# Altium schematic sheet NodeIO.SchDoc
size A4; PageSetup: Record=PageOptions|CenterHorizontal=True|CenterVertical=True|PrintScale=1.00|XCorrection=1.00|YCorrection=1.00|PrintKind=1|BorderSize=5000000|LeftOffset=0|BottomOffset=0|Orientation=2|PaperLength=1000|PaperWidth=1000|Scale=100|PaperSource=7|PrintQuality=-3|MediaType=1|DitherType=10|PrintScaleMode=0|PaperKind=A4|PaperIndex=9
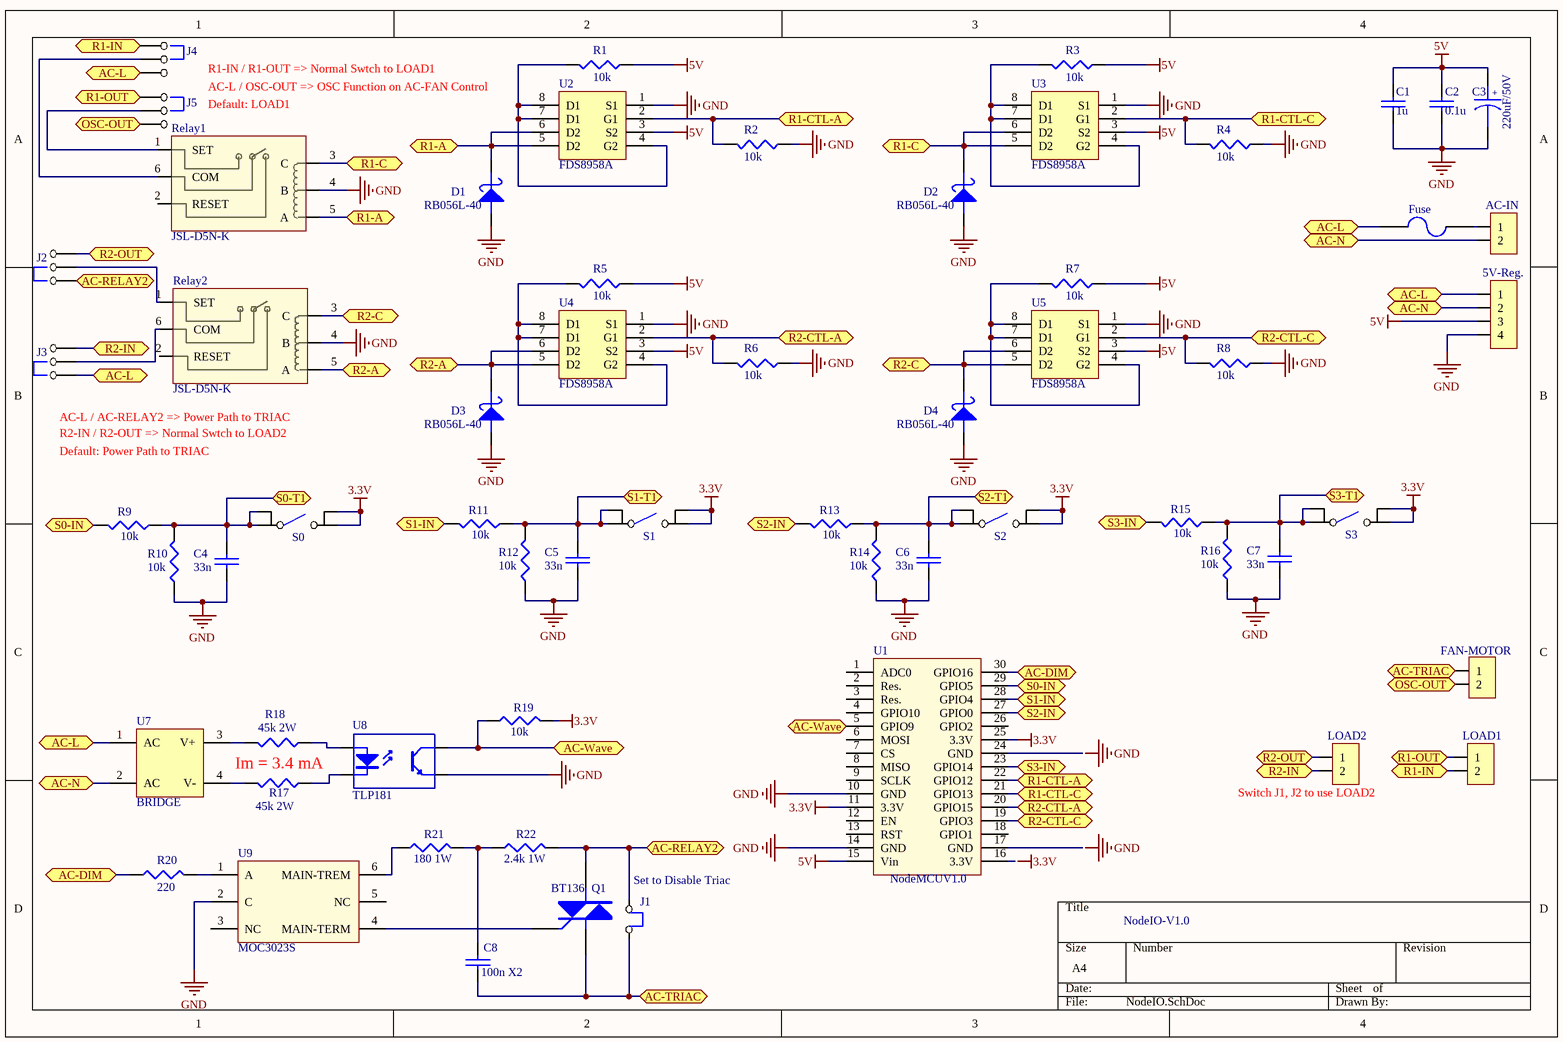
[diagram p0: NodeIO.SchDoc]

## Parts
5V-Reg.  (no value)
AC-IN  (no value)
C1  1u  [C_SMD_2012-0805]
C2  0.1u  [C_SMD_2012-0805]
C3  220uF/50V  [C_ECEL_G]
C4  33n  [C_SMD_2012-0805]
C5  33n  [C_SMD_2012-0805]
C6  33n  [C_SMD_2012-0805]
C7  33n  [C_SMD_2012-0805]
C8  100n X2  [Cap-B32933-EPCOS]
D1  RB056L-40  [DIODE_RB056L-40TE25]
D2  RB056L-40  [DIODE_RB056L-40TE25]
D3  RB056L-40  [DIODE_RB056L-40TE25]
D4  RB056L-40  [DIODE_RB056L-40TE25]
FAN-MOTOR  (no value)
Fuse  (no value)
J1  (no value)  [JUMP 7.5A]
J2  (no value)  [JP_3S_2.0mm]
J3  (no value)  [JP_3S_2.0mm]
J4  (no value)  [JP_3S_2.0mm]
J5  (no value)  [JP_3S_2.0mm]
LOAD1  (no value)
LOAD2  (no value)
Q1  BT136  [TO220V]
R1  10k  [R_2012-0805]
R2  10k  [R_2012-0805]
R3  10k  [R_2012-0805]
R4  10k  [R_2012-0805]
R5  10k  [R_2012-0805]
R6  10k  [R_2012-0805]
R7  10k  [R_2012-0805]
R8  10k  [R_2012-0805]
R9  10k  [R_2012-0805]
R10  10k  [R_2012-0805]
R11  10k  [R_2012-0805]
R12  10k  [R_2012-0805]
R13  10k  [R_2012-0805]
R14  10k  [R_2012-0805]
R15  10k  [R_2012-0805]
R16  10k  [R_2012-0805]
R17  45k 2W  [R_2W_TH]
R18  45k 2W  [R_2W_TH]
R19  10k  [R_2012-0805]
R20  220  [R_2012-0805]
R21  180 1W  [R_2W_TH]
R22  2.4k 1W  [R_2W_TH]
Relay1  JSL-D5N-K  [RELAY-JSL-DxxN-K]
Relay2  JSL-D5N-K  [RELAY-JSL-DxxN-K]
S0  SW-SPST_4_PIN  [SW-TD-06XB-Z]  (value not drawn)
S1  SW-SPST_4_PIN  [SW-TD-06XB-Z]  (value not drawn)
S2  SW-SPST_4_PIN  [SW-TD-06XB-Z]  (value not drawn)
S3  SW-SPST_4_PIN  [SW-TD-06XB-Z]  (value not drawn)
U1  NodeMCUV1.0  [NodeMCUV1.0]
U2  FDS8958A  [SO-8]
U3  FDS8958A  [SO-8]
U4  FDS8958A  [SO-8]
U5  FDS8958A  [SO-8]
U7  BRIDGE  [Bridge-MB8S]
U8  TLP181  [TLP181]
U9  MOC3023S  [SOIC6]

## Ports
AC-DIM, AC-L, AC-N, AC-RELAY2, AC-TRIAC, AC-Wave, OSC-OUT, R1-A, R1-C, R1-CTL-A, R1-CTL-C, R1-IN, R1-OUT, R2-A, R2-C, R2-CTL-A, R2-CTL-C, R2-IN, R2-OUT, S0-IN, S0-T1, S1-IN, S1-T1, S2-IN, S2-T1, S3-IN, S3-T1

## Nets
3.3V: R19.2 S0.3 S0.4 S1.3 S1.4 S2.3 S2.4 S3.3 S3.4 U1.11(3.3V) U1.25(3.3V)
5V: 5V-Reg..3 C1.1 C2.1 C3.1 R1.1 R3.1 R5.1 R7.1 U1.15(Vin) U2.3(S2) U3.3(S2) U4.3(S2) U5.3(S2)
GND: 5V-Reg..4 C1.2 C2.2 C3.2 C4.2 C5.2 C6.2 C7.2 D1.1(A) D2.1(A) D3.1(A) D4.1(A) R2.1 R4.1 R6.1 R8.1 R10.1 R12.1 R14.1 R16.1 Relay1.4(B) Relay2.4(B) U1.10(GND) U1.14(GND) U2.1(S1) U3.1(S1) U4.1(S1) U5.1(S1) U8.3(E) U9.2(C)
AC-DIM: R20.1 U1.30(GPIO16) ; port AC-DIM
AC-L: 5V-Reg..1 Fuse.1 J3.1 J4.3 U7.1(AC) ; port AC-L
AC-N: 5V-Reg..2 AC-IN.2 U7.2(AC) ; port AC-N
AC-RELAY2: J1.1 J2.1 Q1.2(A2) R22.2 ; port AC-RELAY2
AC-TRIAC: C8.1 FAN-MOTOR.1 J1.2 Q1.1(A1) ; port AC-TRIAC
AC-Wave: R19.1 U1.5(GPIO9) U8.4(C) ; port AC-Wave
OSC-OUT: FAN-MOTOR.2 J5.3 ; port OSC-OUT
R1-A: D1.2(K) Relay1.5(A) U2.5(D2) U2.6(D2) ; port R1-A
R1-C: D2.2(K) Relay1.3(C) U3.5(D2) U3.6(D2) ; port R1-C
R1-CTL-A: R2.2 U1.22(GPIO12) U2.2(G1) ; port R1-CTL-A
R1-CTL-C: R4.2 U1.21(GPIO13) U3.2(G1) ; port R1-CTL-C
R1-IN: J4.1 LOAD1.2 ; port R1-IN
R1-OUT: J5.1 LOAD1.1 ; port R1-OUT
R2-A: D3.2(K) Relay2.5(A) U4.5(D2) U4.6(D2) ; port R2-A
R2-C: D4.2(K) Relay2.3(C) U5.5(D2) U5.6(D2) ; port R2-C
R2-CTL-A: R6.2 U1.20(GPIO15) U4.2(G1) ; port R2-CTL-A
R2-CTL-C: R8.2 U1.19(GPIO3) U5.2(G1) ; port R2-CTL-C
R2-IN: J3.3 LOAD2.2 ; port R2-IN
R2-OUT: J2.3 LOAD2.1 ; port R2-OUT
S0-IN: R9.2 U1.29(GPIO5) ; port S0-IN
S0-T1: C4.1 R9.1 R10.2 S0.1 S0.2 ; port S0-T1
S1-IN: R11.2 U1.28(GPIO4) ; port S1-IN
S1-T1: C5.1 R11.1 R12.2 S1.1 S1.2 ; port S1-T1
S2-IN: R13.2 U1.27(GPIO0) ; port S2-IN
S2-T1: C6.1 R13.1 R14.2 S2.1 S2.2 ; port S2-T1
S3-IN: R15.2 U1.23(GPIO14) ; port S3-IN
S3-T1: C7.1 R15.1 R16.2 S3.1 S3.2 ; port S3-T1
NetAC-IN_1: AC-IN.1 Fuse.2
NetC8_2: C8.2 R21.2 R22.1
NetJ2_2: J2.2 Relay2.1(SET)
NetJ3_2: J3.2 Relay2.6(COM)
NetJ4_2: J4.2 Relay1.6(COM)
NetJ5_2: J5.2 Relay1.1(SET)
NetQ1_3: Q1.3(G) U9.4(MAIN-TERM)
NetR1_2: R1.2 U2.4(G2) U2.7(D1) U2.8(D1)
NetR3_2: R3.2 U3.4(G2) U3.7(D1) U3.8(D1)
NetR5_2: R5.2 U4.4(G2) U4.7(D1) U4.8(D1)
NetR7_2: R7.2 U5.4(G2) U5.7(D1) U5.8(D1)
NetR17_1: R17.1 U8.2(K)
NetR17_2: R17.2 U7.4(V-)
NetR18_1: R18.1 U8.1(A)
NetR18_2: R18.2 U7.3(V+)
NetR20_2: R20.2 U9.1(A)
NetR21_1: R21.1 U9.6(MAIN-TREM)

Not connected (* = marked no-connect by the designer): Relay1 2(RESET); Relay2 2(RESET); U1 1(ADC0) 2(Res.) 3(Res.) 4(GPIO10) 6(MOSI) 7(CS) 8(MISO) 9(SCLK) 12(EN) 13(RST) 16(3.3V) 17(GND) 18(GPIO1) 24(GND) 26(GPIO2); U9 3(NC) 5(NC)

## Notes on the sheet
- R1-IN / R1-OUT => Normal Swtch to LOAD1
- AC-L / OSC-OUT => OSC Function on AC-FAN Control
- Default: LOAD1
- R2-IN / R2-OUT => Normal Swtch to LOAD2
- AC-L / AC-RELAY2 => Power Path to TRIAC
- Default: Power Path to TRIAC
- Im = 3.4 mA
- (near LOAD2) Switch J1, J2 to use LOAD2
- (near J1) Set to Disable Triac
- NodeIO-V1.0
- Labels drawn without touching a wire or pin: 3.3V, GND
- (in symbol C_Eletro) +

## Library data of the parts
5V-Reg. = CON4
AC-IN FAN-MOTOR LOAD1 LOAD2 = CON2
C1 C2 C4-C7 = CAP: Type: Multilayer Ceramic Capacitors SMD/SMT 0805 X7R 10%; Prize: 5; Size: 2012/0805
  C1: Value: 1u
  C2: Value: 0.1u
  C4-C7: Value: 33n
C3 = C_Eletro: UWT1C221MCL1GS; Type: Aluminum Electrolytic Capacitors 50V 220uF; Size: G; Value: 220uF/50V
C8 = CAP: Type: Epcos 100nF Polyester Capacitor (PET) 305 Vac ±10%; Prize: 33; Value: 100n X2; link: http://th.rs-online.com/web/p/polyester-film-capacitors/8741437/; link2: http://th.rs-online.com/web/p/polyester-film-capacitors/8740797/; Supplier#1: rs-online
D1-D4 = Diode_Schottky: Manufacturer: ROHM Semiconductor; Prize: 2.14; Type: RB056L-40TE25  Schottky Diode 40V/3A, General Purpose Small, Power Mold Type.(PMDS); Supplier#1: es.co.th; Supplier#1_ID: 0176-0228-9; Value: RB056L-40
Fuse = Fuse: Manufacturer: TELE LONG; Relate_Part: 0054-0030-0; Prize: 11.09; Value: F20; Supplier#1_ID: 0234-0026-6; Supplier#1: es.co.th; Type: Fuse Holder 5.2x20mm
J1 = Jumper2
J2-J5 = Jumper3
Q1 = TRIAC: Manufacturer: PHILIPS/NXP; Prize: 6.18; Type: Sensitive Gates Triac 600V/4A, Logic Level; Value: BT136; Supplier#1_ID: 0016-0082-8; Supplier#1: es.co.th
R1-R22 = Resistor
  R1-R8: Type: Thick Film Resistors - SMD 0603 1/4W 1%; Size: 2012/0805; Value: 10k
  R9-R16: Type: Thick Film Resistors - SMD 0603 1/10W 1%; Size: 2012/0805; Value: 10k
  R17 R18: Type: Ceramic; Size: need update; Value: 45k 2W
  R19: Type: Thick Film Resistors - SMD 1/10W 1%; Size: 2012/0805; Value: 10k
  R20: Type: Thick Film Resistors - SMD 0603 1/4W 1%; Size: 2012/0805; Value: 220
  R21: Type: Ceramic; Size: need update; Value: 180 1W
  R22: Type: Ceramic; Size: need update; Value: 2.4k 1W
Relay1 Relay2 = Latching-Relay-2Coils: Manufacturer: FUJITSU COMPONENTS; Prize: 54.94; Supplier#1: es.co.th; Supplier#1_ID: 0032-0251-1; Type: Power Relay Coil 5VDC, 1 Form C (SPDT) Contact Rating 8A 250VAC/24VDC Latching Type, 2-Coil Winding; Value: JSL-D5N-K
S0-S3 = SW-SPST_4_PIN: Manufacturer: WEALTH METAL; Prize: 2.02; Supplier#1: es.co.th; Supplier#1_ID: 0171-0079-7; Value: SW-SPST_4_PIN; Type: Tact Switch 6x6MM, 4 Pins SMD, SPST-NO 12Vdc/50mA, 7mm STEM LENGTH
U2-U5 = FDS8958A: Manufacturer: FAIRCHILD; Prize: 11.31; Supplier#1: es.co.th; Supplier#1_ID: 0123-0509-8; Value: FDS8958A; Type: MOSFET Dual N and P-Channel 30V/7A,5A,2W Rds(on) 19mΩ,42mΩ Typ.
U7 = BRIDGE_2: Diode Bridge
U8 = TLP181: Manufacturer: TOSHIBA; Prize: 7.18; Type: IC PHOTOCOUPLER, VCE=80V, ISOLATION VOLTAGE 3750V 100-300% CURRENT TRANSFER RATIO; Value: TLP181; Supplier#1: es.co.th; Supplier#1_ID: 0087-0213-6
U9 = MOC30xx: Manufacturer: LITE-ON; Prize: 10.92; Supplier#1_ID: 0013-0019-0; Supplier#1: es.co.th; Type: Photocoupler Triac Driver Output; Value: MOC3023S